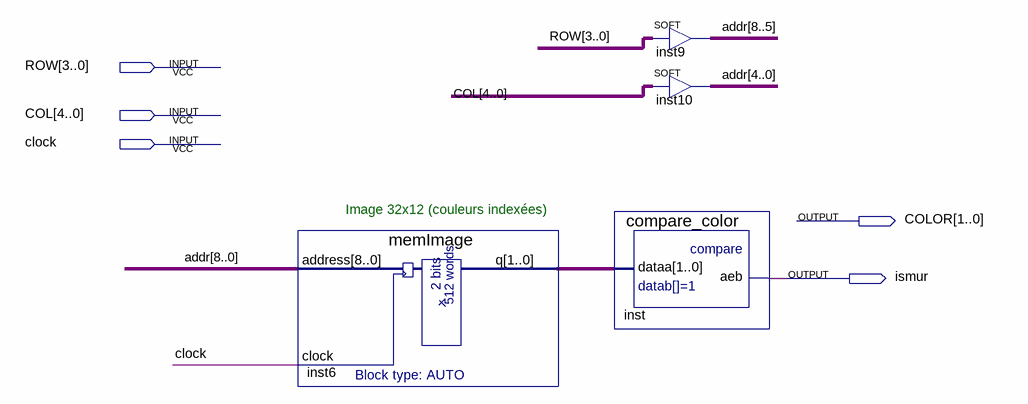
[diagram p0: schematic sheet]
// Quartus schematic TestBlock.bdf as structural Verilog: 4 symbols, 5 pins
module TestBlock (
  input  [3:0] ROW,
  input  [4:0] COL,
  input  clock,
  output [1:0] COLOR,
  output ismur
);

  wire [1:0] inst6_q;
  wire [8:0] addr;

  memImage inst6 (.address(addr), .clock(clock), .q(inst6_q));
  compare_color inst (.dataa(inst6_q), .aeb(ismur));
  SOFT inst9[3:0] (.IN(ROW), .OUT(addr[8:5]));
  SOFT inst10[4:0] (.IN(COL), .OUT(addr[4:0]));

  // Notes on the sheet:
  //   Image 32x12 (couleurs indexées)
endmodule
